# EAGLE schematic RJ45_connector_y (EAGLE 7.0.0)
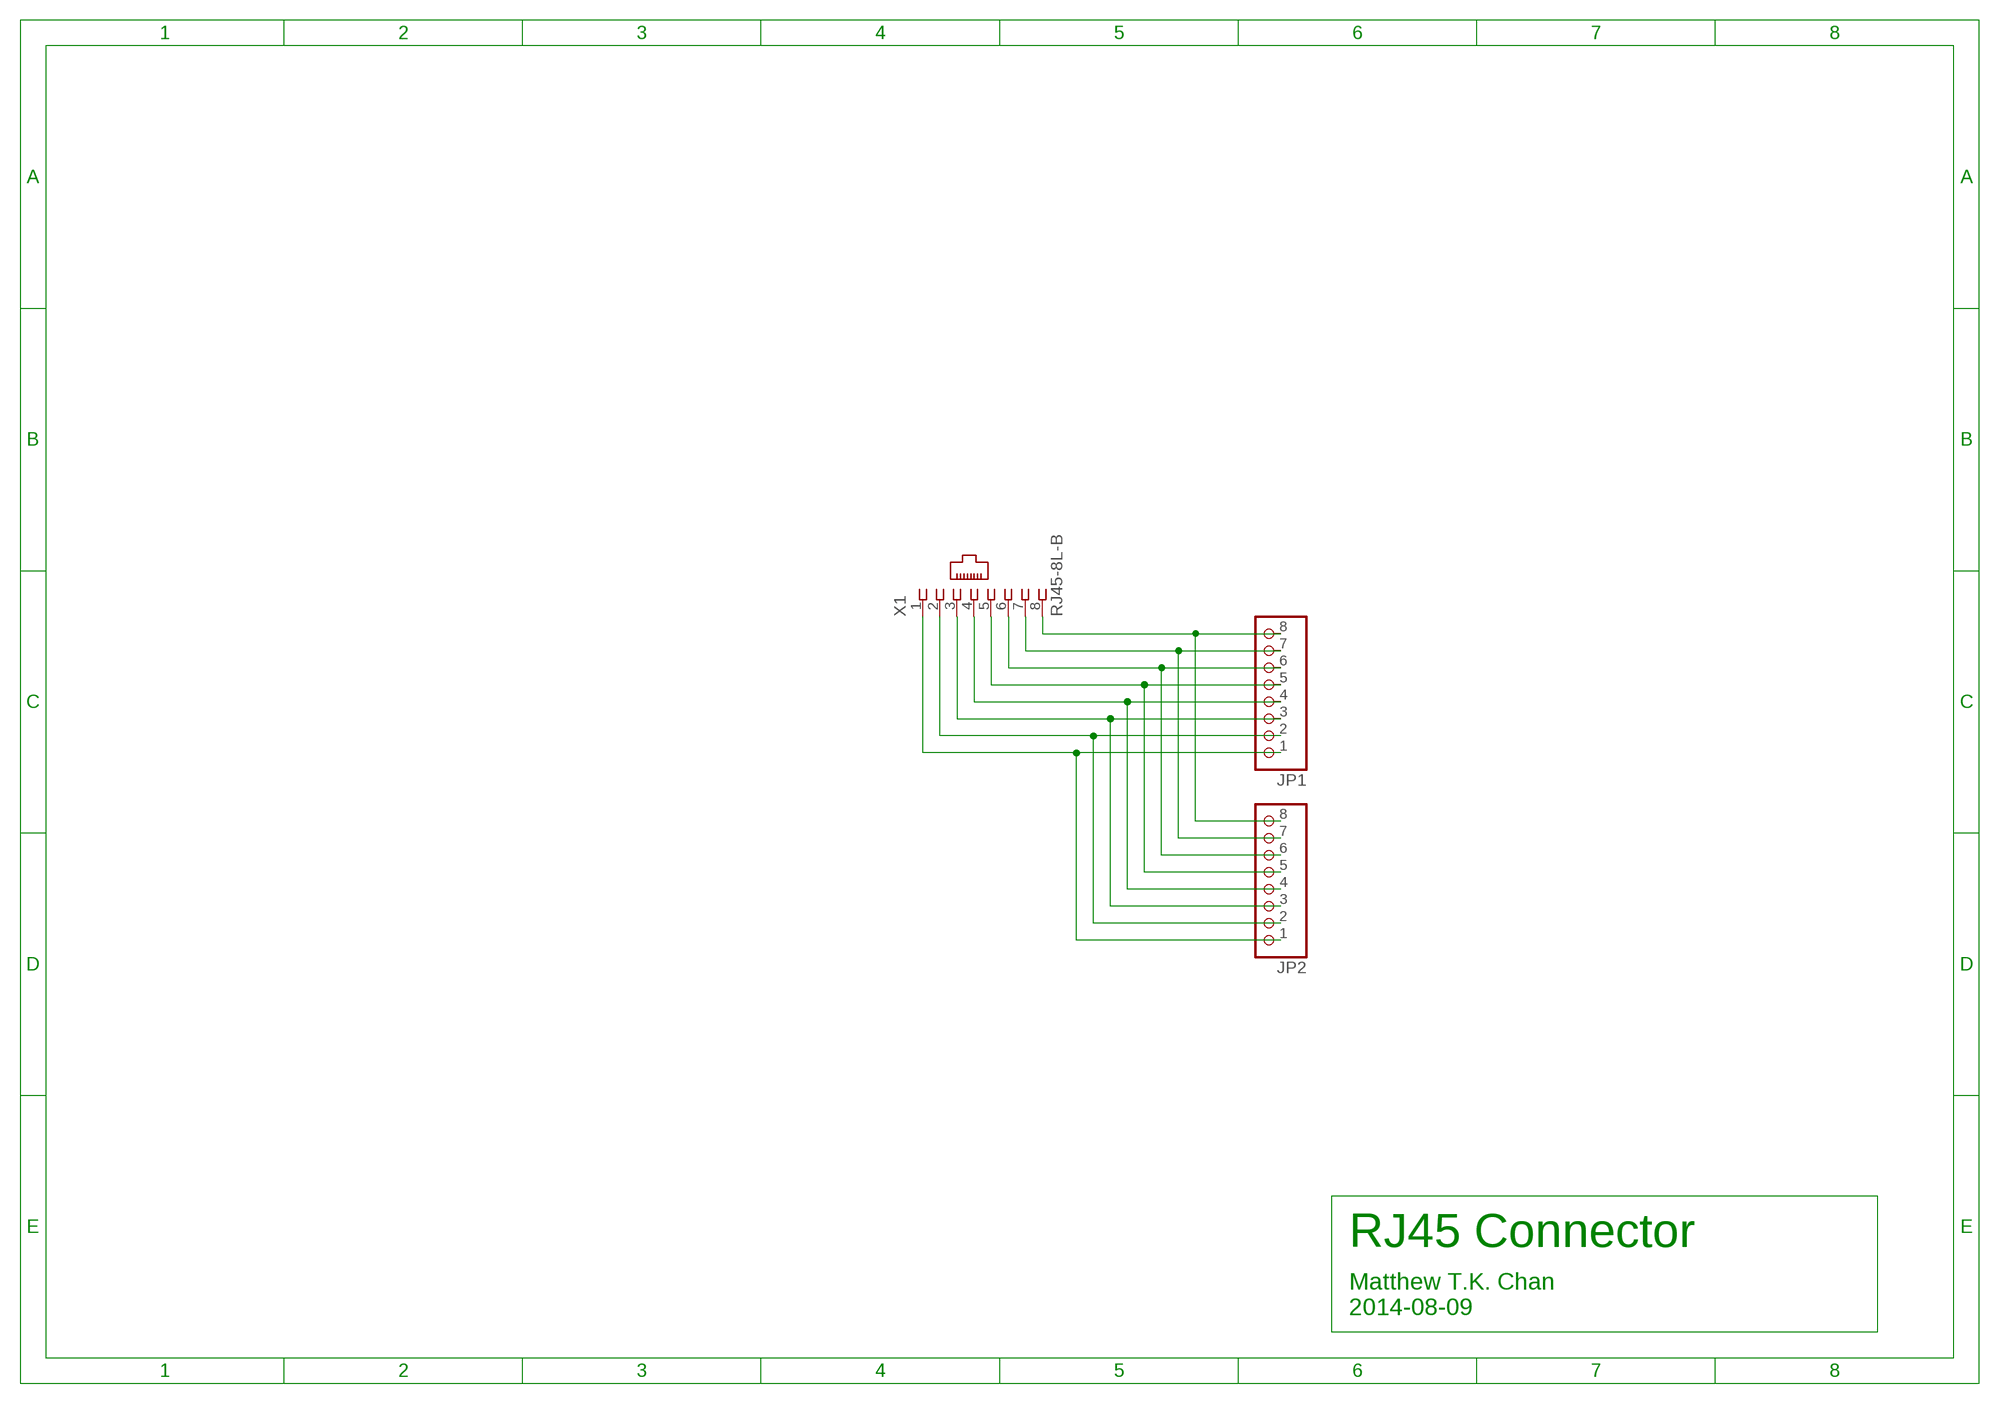
[diagram p0: schematic, sheet 1]

## Parts
JP1  PINHD-1X8  [1X08]
JP2  PINHD-1X8  [1X08]
X1  RJ45-8L-B  [RJ45-NO-SHIELD]

## Nets
N$1: JP1.8 JP2.8 X1.8
N$2: JP1.7 JP2.7 X1.7
N$3: JP1.6 JP2.6 X1.6
N$4: JP1.5 JP2.5 X1.5
N$5: JP1.4 JP2.4 X1.4
N$6: JP1.3 JP2.3 X1.3
N$7: JP1.2 JP2.2 X1.2
N$8: JP1.1 JP2.1 X1.1

## Notes on the sheet
- RJ45 Connector
- Matthew T.K. Chan
  2014-08-09

## Library data of the parts
JP1 JP2 = pinhead:PINHD-1X8: PIN HEADER
X1 = CBLA_Test_bed_Library:RJ45: CORCOM Modular RJ Jacks No Shield Source: www.tycoelectronics.com .. ENG_DS_1654001_1099_RJ_L_0507.pdf; MF: TYCO ELECTRONICS; MPN: RJ45-8L-B; OC_FARNELL: 1279843; OC_NEWARK: 52K4445